# EAGLE schematic untitled (EAGLE 6.5.0)
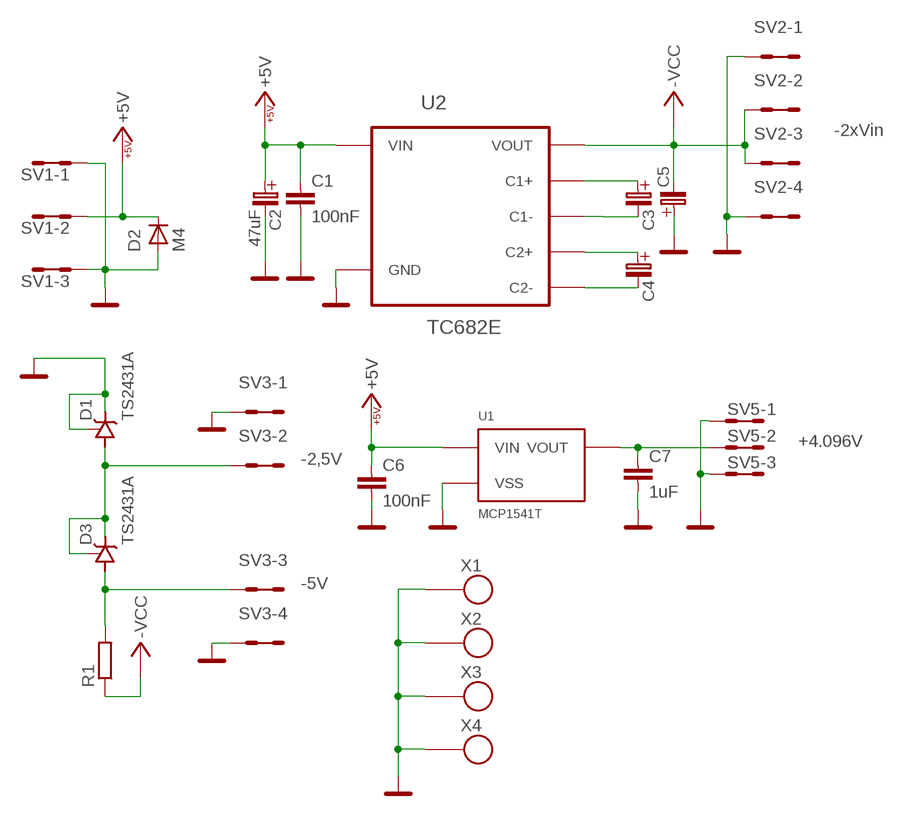
[diagram p0: schematic, sheet 1]

## Parts
C1  100nF  C0805  [C0805]
C2  47uF  C  [C]
C3  C  [C]
C4  C  [C]
C5  C  [C]
C6  100nF  C0805  [C0805]
C7  1uF  C0805  [C0805]
D1  TS2431A  [SOT23]
D2  M4  D-OB.SMA  [SMA]
D3  TS2431A  [SOT23]
R1  R0805  [0805]
SV1  MA03-2  [MA03-2]
SV2  MA04-2  [MA04-2]
SV3  MA04-2  [MA04-2]
SV5  MA03-2  [MA03-2]
U1  MCP1541T  [SOT23]
U2  TC682E  TC682  [SO8]
X1  SROUB3M  [SROUB3M]
X2  SROUB3M  [SROUB3M]
X3  SROUB3M  [SROUB3M]
X4  SROUB3M  [SROUB3M]

## Nets
+5V: C1.1 C2.+(C_EL+) C6.1 D2.K(C) SV1.3 SV1.4 U1.1(VIN) U2.6(VIN)
-VCC: C5.-(C_EL-) R1.1 SV2.3 SV2.4 SV2.5 SV2.6 U2.4(VOUT)
GND: C1.2 C2.-(C_EL-) C5.+(C_EL+) C6.2 C7.2 D1.1(K) D1.2 D2.A SV1.1 SV1.2 SV1.5 SV1.6 SV2.1 SV2.2 SV2.7 SV2.8 SV3.1 SV3.2 SV3.7 SV3.8 SV5.1 SV5.2 SV5.5 SV5.6 U1.3(VSS) U2.5(GND) X1.P$1 X2.P$1 X3.P$1 X4.P$1
N$1: C3.-(C_EL-) U2.1(C1-)
N$2: C3.+(C_EL+) U2.7(C1+)
N$3: C4.+(C_EL+) U2.2(C2+)
N$4: C4.-(C_EL-) U2.3(C2-)
N$5: D3.3(A) R1.2 SV3.5 SV3.6
N$6: D1.3(A) D3.1(K) D3.2 SV3.3 SV3.4
N$10: C7.1 SV5.3 SV5.4 U1.2(VOUT)

## Notes on the sheet
- -2xVin
- +4.096V
- -2,5V
- -5V

## Library data of the parts
C1 C6 C7 = moje_C:C0805
C2-C5 = moje_C:C
D1 D3 = moje_diody:TS2431A: Reference 2,5V (i pro -2,5V) SOT 23
D2 = moje:D-OB.SMA: SMA
R1 = moje_R:R0805
SV1 SV5 = moje_hrebinky:MA03-2: PIN HEADER; OC_FARNELL: unknown; OC_NEWARK: unknown
SV2 SV3 = moje_hrebinky:MA04-2: PIN HEADER; OC_FARNELL: unknown; OC_NEWARK: unknown
U1 = moje_diody:MCP1541T
U2 = moje_io:TC682: Nábojová pumpa -Vin -2vin
X1-X4 = moje:SROUB3M